# Altium schematic sheet 13-multimodal-connections.SchDoc
size A; SheetNumber: 10; SheetTotal: 11
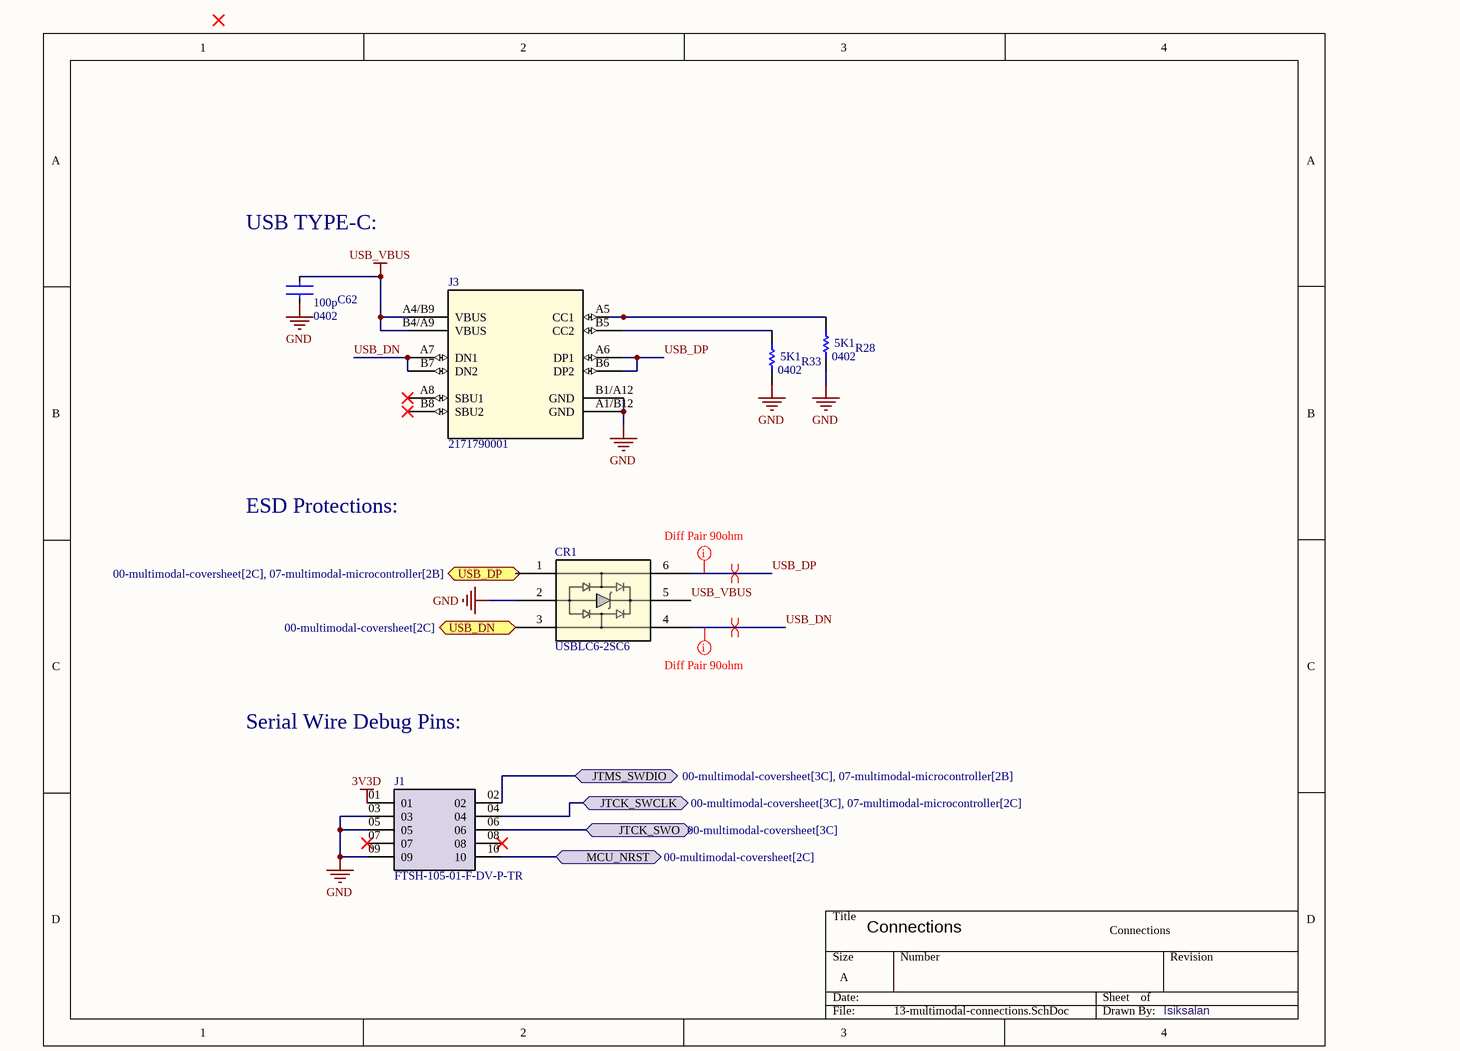
[diagram p0: 13-multimodal-connections.SchDoc]

## Parts
C62  CGA2B2C0G1H101J050BA  [CAPTDK0402]  (value not drawn)
CR1  USBLC6-2SC6  [SOT-23]
J1  FTSH-105-01-F-DV-P-TR  [SAMTEC_FTSH-105-01-F-DV-P-TR]
J3  2171790001  [2171790001_MOL]
R28  ERA-2AEB512X  [RES-STACK-POLE-0402]  (value not drawn)
R33  ERA-2AEB512X  [RES-STACK-POLE-0402]  (value not drawn)

## Ports
JTCK_SWCLK (bidir, see 00-multimodal-coversheet[3C], 07-multimodal-microcontroller[2C]), JTCK_SWO (bidir, see 00-multimodal-coversheet[3C]), JTMS_SWDIO (bidir, see 00-multimodal-coversheet[3C], 07-multimodal-microcontroller[2B]), MCU_NRST (bidir, see 00-multimodal-coversheet[2C]), USB_DN (bidir, see 00-multimodal-coversheet[2C]), USB_DP (bidir, see 00-multimodal-coversheet[2C], 07-multimodal-microcontroller[2B])

## Nets
3V3D: J1.01
GND: C62.2 CR1.2 J1.03 J1.05 J1.09 J3.A1/B12(GND) J3.B1/A12(GND) R28.1 R33.1
USB_VBUS: C62.1 CR1.5 J3.A4/B9(VBUS) J3.B4/A9(VBUS)
JTCK_SWCLK: J1.04 ; port JTCK_SWCLK
JTCK_SWO: J1.06 ; port JTCK_SWO
JTMS_SWDIO: J1.02 ; port JTMS_SWDIO
MCU_NRST: J1.10 ; port MCU_NRST
USB_DN: CR1.4 J3.A7(DN1) J3.B7(DN2)
USB_DN: CR1.3 ; port USB_DN  [a separate net that carries the same name]
USB_DP: CR1.6 J3.A6(DP1) J3.B6(DP2)
USB_DP: CR1.1 ; port USB_DP  [a separate net that carries the same name]
NetJ3_A5: J3.A5(CC1) R28.2
NetJ3_B5: J3.B5(CC2) R33.2

Not connected (* = marked no-connect by the designer): J1 07* 08*; J3 A8(SBU1)* B8(SBU2)*

## Layout directives
differential pair: USB_DN, USB_DP
mark named Diff Pair 90ohm: USB_DN, USB_DP

## Notes on the sheet
- (near C62) USB TYPE-C:
- ESD Protections:
- Serial Wire Debug Pins:
- Connections
- Isiksalan
- (in symbol CGA2B2C0G1H101J050BA) 100p; 0402
- (in symbol ERA-2AEB512X) 5K1; 0402

## Library data of the parts
C62 = CGA2B2C0G1H101J050BA: CAP CER 100PF 50V C0G 0402; Supplier 1: Digi-Key; Supplier Part Number 1: 445-5596-1-ND
CR1 = USBLC6-2SC6: ESD Protection for USB 2.0 High Speed; Manufacturer_Name: STMicroelectronics; Copyright: Copyright (C) 2025 Ultra Librarian. All rights reserved.; Manufacturer_Part_Number: USBLC6-2SC6; RefDes: RefDes; Type: Type; Supplier 1: Avnet; Supplier Part Number 1: USBLC6-2SC6
J1 = FTSH-105-01-F-DV-P-TR: Connector Header Surface Mount 10 position 0.050" (1.27mm); MF: Samtec Inc.; MP: FTSH-105-01-F-DV-K-TR; SnapEDA_Link: https://www.snapeda.com/parts/FTSH-105-01-F-DV-K-TR/Samtec/view-part/?ref=snap; Package: None; Value: *; Check_prices: https://www.snapeda.com/parts/FTSH-105-01-F-DV-K-TR/Samtec/view-part/?ref=eda
J3 = 2171790001: Universal Serial Bus (USB) Shielded I/O Receptacle, Type C, Right-Angle, Top Mount, Surface Mount, Single Row, 16 Circuits, Gold (Au) Plating; Manufacturer_Name: Molex Connector Corporation; Copyright: Copyright (C) 2025 Ultra Librarian. All rights reserved.; Manufacturer_Part_Number: 2171790001; RefDes: RefDes; Type: Type
R28 R33 = ERA-2AEB512X: RES SMD 5.1K OHM 0.1% 1/16W 0402; Supplier 1: Arrow Electronics; Supplier Part Number 1: ERA-2AEB512X